# EAGLE schematic UsbA (EAGLE 6.5.0)
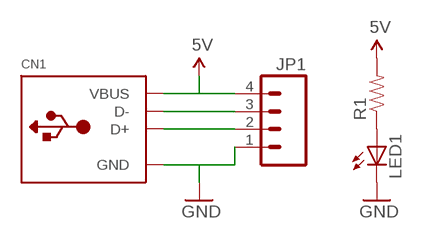
[diagram p0: schematic, sheet 1]

## Parts
CN1  USB_TYPEAPCB  [USBA_PCB]
JP1  M04PTH  [1X04]
LED1  LED5MM  [LED5MM]
R1  RESISTORAXIAL-0.3  [AXIAL-0.3]

## Nets
5V: CN1.VCC(VBUS) JP1.4 R1.P$2
D+: CN1.USB_PLUS(D+) JP1.2
D-: CN1.USB_NEG(D-) JP1.3
GND: CN1.GND JP1.1 LED1.K(C)
N$1: LED1.A R1.P$1

## Library data of the parts
CN1 = barbary_enterprises:USB_TYPEA: USB - Type A Connectors Male types stick out and are inserted into a PC or matching females parts (these are the connectors used on USB Memory Sticks, etc.). Female parts are generally used for USB Host and accept a male-type connector. SMT Male - 4UCON: 10017 PTH Female - Digikey: 609-1045-ND, 4UCon: 05241
JP1 = SparkFun-Connectors:M04: Header 4 Standard 4-pin 0.1" header. Use with straight break away headers (SKU : PRT-00116), right angle break away headers (PRT-00553), swiss pins (PRT-00743), machine pins (PRT-00117), and female headers (PRT-00115). Molex polarized connector foot print use with SKU : PRT-08231 with associated crimp pins and housings. 1MM SMD Version SKU: PRT-10208
LED1 = SparkFun-LED:LED: LEDs Standard schematic elements and footprints for 5mm, 3mm, 1206, and 0603 sized LEDs. 5mm - Spark Fun Electronics SKU : COM-00529 (and others)
R1 = SparkFun-Resistors:RESISTOR: Resistor Basic schematic elements and footprints for 0603, 1206, and PTH resistors.